# Altium schematic sheet Microcontrolador.SchDoc
size B
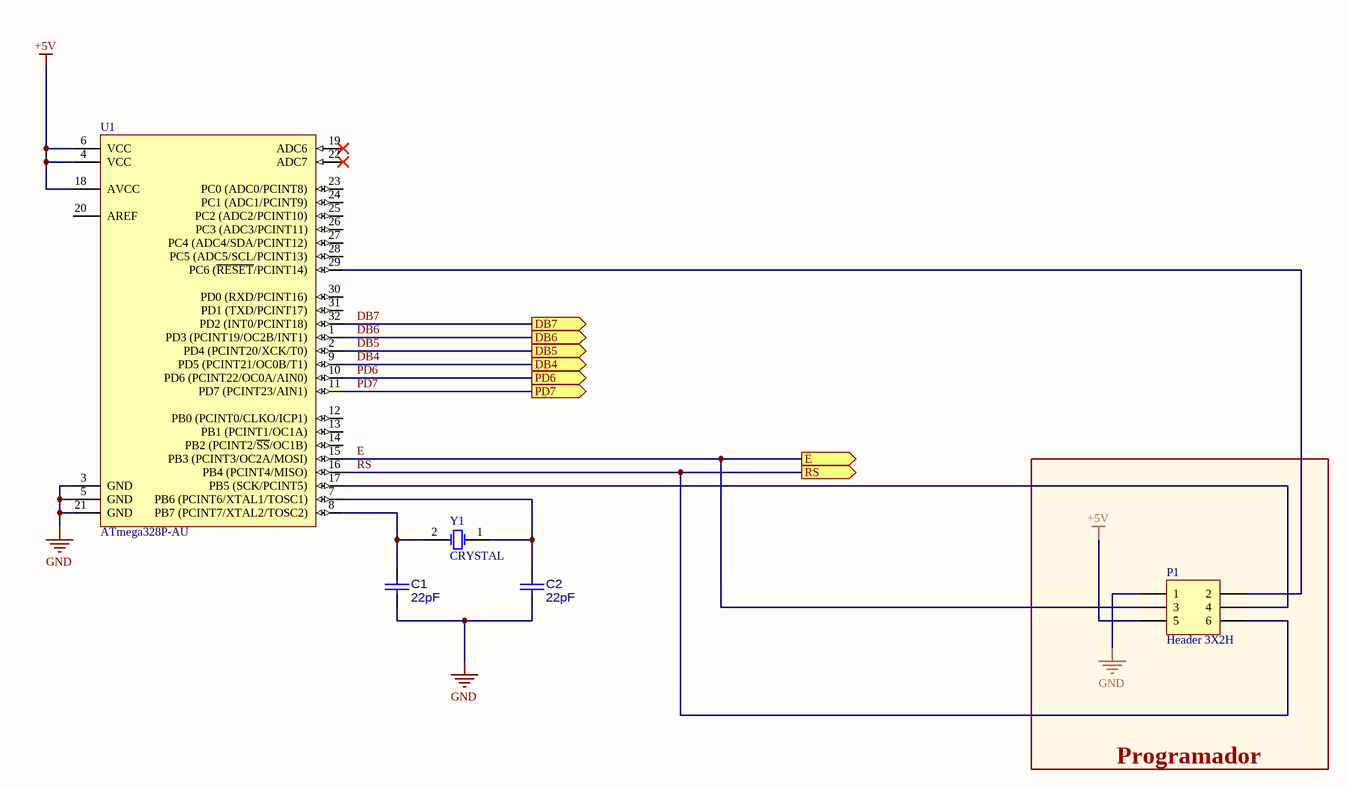
[diagram p0: Microcontrolador.SchDoc]

## Parts
C1  22pF  [CAP0805]
C2  22pF  [CAP0805]
P1  Header 3X2H  [HDR-2X3]
U1  ATmega328P-AU  [32A]
Y1  CRYSTAL  [HC49S-SMD]

## Blocks framed on the sheet
Programador: P1

## Ports
DB4 (out), DB5 (out), DB6 (out), DB7 (out), E (out), PD6 (out), PD7 (out), RS (out)

## Nets
+5V: P1.5 U1.4(VCC) U1.6(VCC) U1.18(AVCC)
GND: C1.2 C2.2 P1.1 U1.3(GND) U1.5(GND) U1.21(GND)
DB4: U1.9(PD5_(PCINT21/OC0B/T1)) ; port DB4
DB5: U1.2(PD4_(PCINT20/XCK/T0)) ; port DB5
DB6: U1.1(PD3_(PCINT19/OC2B/INT1)) ; port DB6
DB7: U1.32(PD2_(INT0/PCINT18)) ; port DB7
E: P1.3 U1.15(PB3_(PCINT3/OC2A/MOSI)) ; port E
PD6: U1.10(PD6_(PCINT22/OC0A/AIN0)) ; port PD6
PD7: U1.11(PD7_(PCINT23/AIN1)) ; port PD7
RS: P1.6 U1.16(PB4_(PCINT4/MISO)) ; port RS
NetC1_1: C1.1 U1.8(PB7_(PCINT7/XTAL2/TOSC2)) Y1.2(OSC2)
NetC2_1: C2.1 U1.7(PB6_(PCINT6/XTAL1/TOSC1)) Y1.1(OSC1)
NetP1_2: P1.2 U1.29(PC6_(~{RESET}/PCINT14))
NetP1_4: P1.4 U1.17(PB5_(SCK/PCINT5))

Not connected (* = marked no-connect by the designer): U1 12(PB0_(PCINT0/CLKO/ICP1)) 13(PB1_(PCINT1/OC1A)) 14(PB2_(PCINT2/~{SS}/OC1B)) 19(ADC6)* 20(AREF) 22(ADC7)* 23(PC0_(ADC0/PCINT8)) 24(PC1_(ADC1/PCINT9)) 25(PC2_(ADC2/PCINT10)) 26(PC3_(ADC3/PCINT11)) 27(PC4_(ADC4/SDA/PCINT12)) 28(PC5_(ADC5/SCL/PCINT13)) 30(PD0_(RXD/PCINT16)) 31(PD1_(TXD/PCINT17))

## Library data of the parts
C1 C2 = CAP_4: Footprint: 0805CAP; Digikey: 1276-1007-1-ND; Value: 22pF
P1 = Header 3X2H: Header, 3-Pin, Dual row, Right Angle; LatestRevisionDate: 17-Jul-2002; LatestRevisionNote: Re-released for DXP Platform.; Publisher: Altium Limited
U1 = ATmega328P-AU: 8-bit AVR Microcontroller, 32KB Flash, 1KB EEPROM, 2KB SRAM, 32-pin TQFP, Industrial Grade (-40°C to 85°C); Published: 1-Apr-2010; DatasheetVersion: revA, Jan-2010; PackageVersion: revB, Oct-2001; PackageReference: 32A; Publisher: Altium Limited; PackageDescription: 32-Lead, 7x7x1.0 mm Body, 0.8mm Lead Pitch, Thin Profile Plastic Quad Flat Package (TQFP); Supplier 1: Digi-Key; Supplier Part Number 1: ATMEGA328P-AU-ND; Supplier 2: Farnell; Supplier Part Number 2: 1715486; Supplier 3: Mouser; Supplier Part Number 3: 556-ATMEGA328P-AU; Code_JEDEC: MS-026-ABA; ComponentLink1Description: Manufacturer Link; ComponentLink1URL: http://www.atmel.com/products/avr/default.asp?; ComponentLink2Description: ATmega48A/48PA/88A/88PA/168A/168PA/328/328P Datasheet; ComponentLink2URL: http://www.atmel.com/dyn/resources/prod_documents/8271.pdf; ComponentLink3Description: ATmega48A/48PA/88A/88PA/168A/168PA/328/328P Summary; ComponentLink3URL: http://www.atmel.com/dyn/resources/prod_documents/8271S.pdf; ComponentLink4Description: Atmel.com Home; ComponentLink4URL: http://www.atmel.com
Y1 = CRYSTAL: Crystal Oscillator